# Altium project IFAT6.PrjPcb (part 1 of 3)
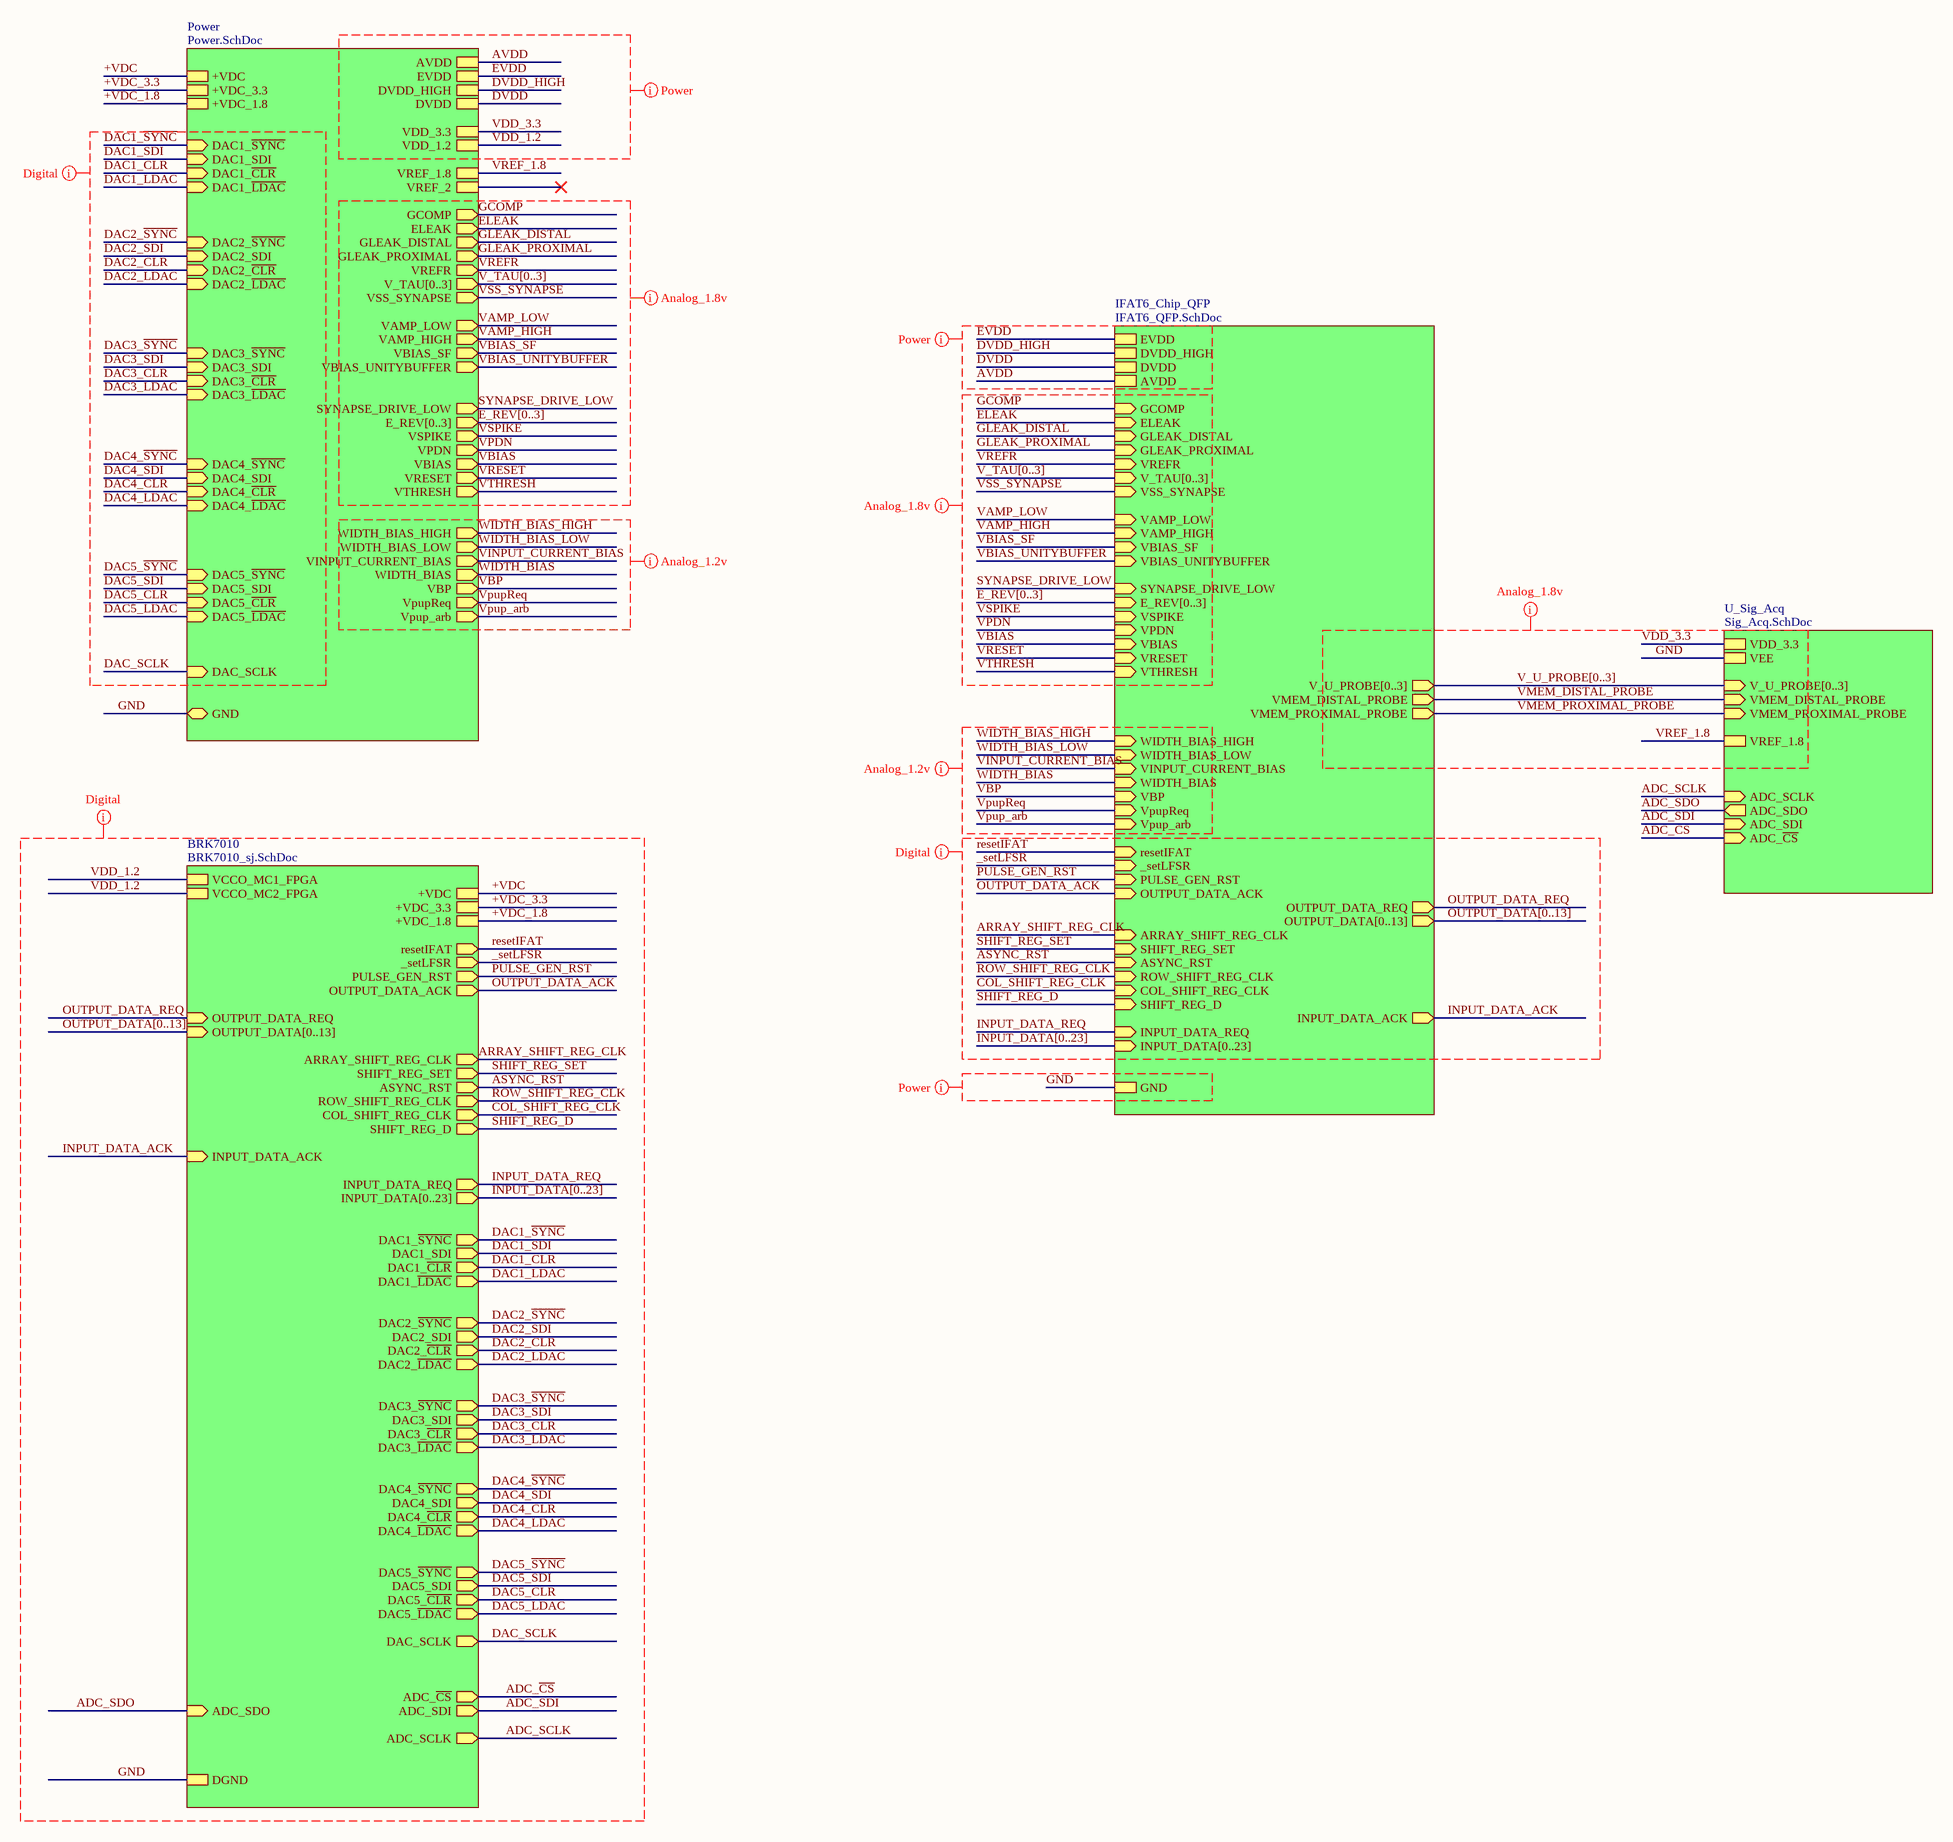
[diagram p0: IFAT6.SchDoc]
10 sheets, 589 parts. Net scope: strictly hierarchical (ports join the sheet entries above them; power ports are local).
Board file: IFAT6.PcbDoc
Sheets:
  IFAT6.SchDoc
    IFAT6_Chip_QFP = IFAT6_QFP.SchDoc
      C_EVDD = Capx3_small_bypass.SchDoc
      DVDD_HI = Capx3_small_bypass.SchDoc
      DVDD = Capx3_small_bypass.SchDoc
      VSS_SYN = Capx3_small_bypass.SchDoc
      VAMP_LOW = Capx3_small_bypass.SchDoc
      C_EVDD = Capx3_small_bypass.SchDoc
      GCOMP = Capx3_small_bypass.SchDoc
      ELEAK = Capx3_small_bypass.SchDoc
      C_AVDD = Capx3_small_bypass.SchDoc
      GL_DIS = Capx3_small_bypass.SchDoc
      GL_PROX = Capx3_small_bypass.SchDoc
      V_TAU3 = Capx3_small_bypass.SchDoc
      V_TAU2 = Capx3_small_bypass.SchDoc
      C_AVDD1 = Capx3_small_bypass.SchDoc
      V_TAU0 = Capx3_small_bypass.SchDoc
      VREFR = Capx3_small_bypass.SchDoc
      V_TAU1 = Capx3_small_bypass.SchDoc
      VAMP_HIGH = Capx3_small_bypass.SchDoc
      VBIAS_BUFF = Capx3_small_bypass.SchDoc
      SYN_DR_LO = Capx3_small_bypass.SchDoc
      VBIAS_SF = Capx3_small_bypass.SchDoc
      E_REV0 = Capx3_small_bypass.SchDoc
      E_REV1 = Capx3_small_bypass.SchDoc
      E_REV2 = Capx3_small_bypass.SchDoc
      E_REV3 = Capx3_small_bypass.SchDoc
      VSPIKE = Capx3_small_bypass.SchDoc
      WBIAS = Capx3_small_bypass.SchDoc
      VPDN = Capx3_small_bypass.SchDoc
      VBIAS = Capx3_small_bypass.SchDoc
      VRESET = Capx3_small_bypass.SchDoc
      VTHRESH = Capx3_small_bypass.SchDoc
      VIN_IBIAS = Capx3_small_bypass.SchDoc
      WBIAS_HI = Capx3_small_bypass.SchDoc
      WBIAS_LO = Capx3_small_bypass.SchDoc
      VBP = Capx3_small_bypass.SchDoc
      VpupReq = Capx3_small_bypass.SchDoc
      VpupArb = Capx3_small_bypass.SchDoc
    Power = Power.SchDoc
      LDO_All = LDO_All.SchDoc
        AVDD = LDO_Pos.SchDoc
          U_Capx4 = Capx4.SchDoc
        DVDD_HIGH = LDO_Pos.SchDoc
          U_Capx4 = Capx4.SchDoc
        EVDD = LDO_Pos.SchDoc
          U_Capx4 = Capx4.SchDoc
        DVDD = LDO_Pos.SchDoc
          U_Capx4 = Capx4.SchDoc
        VDD_3.3 = LDO_Pos.SchDoc
          U_Capx4 = Capx4.SchDoc
        VREF_2v = LDO_Pos.SchDoc
          U_Capx4 = Capx4.SchDoc
        VREF_1.8 = LDO_Pos.SchDoc
          U_Capx4 = Capx4.SchDoc
        VDD_1.2 = LDO_Pos.SchDoc
          U_Capx4 = Capx4.SchDoc
      DAC = DAC.SchDoc
        VREF_1.8_DAC = Capx4.SchDoc
        AVDD_DAC = Capx4.SchDoc
        EVDD_DAC = Capx4.SchDoc
        DVDD_DAC = Capx4.SchDoc
        DVDD_HI_DAC = Capx4.SchDoc
        VREF_2_DAC = Capx4.SchDoc
        VREF_DAC1 = Capx4.SchDoc
        VDC_DAC1 = Capx4.SchDoc
        VREF_DAC2 = Capx4.SchDoc
        VDC_DAC2 = Capx4.SchDoc
        VREF_DAC3 = Capx4.SchDoc
        VDC_DAC3 = Capx4.SchDoc
        VREF_DAC4 = Capx4.SchDoc
        VDC_DAC4 = Capx4.SchDoc
        VREF_DAC5 = Capx4.SchDoc
        VDC_DAC5 = Capx4.SchDoc
        VTAU1_DAC = Capx4.SchDoc
        GCOMP_DAC = Capx4.SchDoc
        EL_DAC = Capx4.SchDoc
        GLDIST_DAC = Capx4.SchDoc
        VTAU0_DAC = Capx4.SchDoc
        VTAU2_DAC = Capx4.SchDoc
        GLPROX_DAC = Capx4.SchDoc
        VTAU3_DAC = Capx4.SchDoc
        VB_BUFF_DAC = Capx4.SchDoc
        VREFR_DAC = Capx4.SchDoc
        VSS_SYN_DAC = Capx4.SchDoc
        VAMP_LOW_DAC = Capx4.SchDoc
        VBIAS_SF_DAC = Capx4.SchDoc
        SYN_DRLO_DAC = Capx4.SchDoc
        VAMP_HI_DAC = Capx4.SchDoc
        VSPIKE_DAC = Capx4.SchDoc
        VPDN_DAC = Capx4.SchDoc
        V_EREV0_DAC = Capx4.SchDoc
        V_EREV1_DAC = Capx4.SchDoc
        V_EREV2_DAC = Capx4.SchDoc
        V_EREV3_DAC = Capx4.SchDoc
        VBIAS_DAC = Capx4.SchDoc
        VRESET_DAC = Capx4.SchDoc
        VTHRESH_DAC = Capx4.SchDoc
        VBP_DAC = Capx4.SchDoc
        WBIAS_HI_DAC = Capx4.SchDoc
        WBIAS_LO_DAC = Capx4.SchDoc
        IN_IBIAS_DAC = Capx4.SchDoc
        WBIAS_DAC = Capx4.SchDoc
        VpupReq_DAC = Capx4.SchDoc
        Vpup_arb_DAC = Capx4.SchDoc
        VDD_1.2_DAC = Capx4.SchDoc
    U_Sig_Acq = Sig_Acq.SchDoc
      C_+VDC3 = Capx3_small_bypass.SchDoc
      C_+VDC2 = Capx3_small_bypass.SchDoc
      C_+VDC1 = Capx3_small_bypass.SchDoc
      DVDD_ADC = Capx4.SchDoc
      REF_ADC = Capx4.SchDoc
      AVDD_ADC = Capx4.SchDoc
    BRK7010 = BRK7010_sj.SchDoc
      +VDC_FPGA1 = Capx4.SchDoc
      C_VCCO2_FPGA = Capx3_small_bypass.SchDoc
      +VDC_FPGA2 = Capx4.SchDoc
      +VDC_FPGA3 = Capx4.SchDoc
      +VDC_FPGA5 = Capx3_small_bypass.SchDoc
      +VDC_FPGA6 = Capx3_small_bypass.SchDoc
      +VDC_FPGA4 = Capx4.SchDoc
      +VDC_FPGA7 = Capx3_small_bypass.SchDoc
      C_VCCO1_FPGA = Capx3_small_bypass.SchDoc

## Sheet IFAT6.SchDoc: IFAT6 PCB
size C; Revision: 1.0

### Sub-sheets
BRK7010 = BRK7010_sj.SchDoc: VCCO_MC2_FPGA, DGND, +VDC, +VDC_3.3, INPUT_DATA[0..23] (out), OUTPUT_DATA[0..13] (in), resetIFAT (out), _setLFSR (out), PULSE_GEN_RST (out), OUTPUT_DATA_ACK (out), OUTPUT_DATA_REQ (in), ARRAY_SHIFT_REG_CLK (out), SHIFT_REG_SET (out), ASYNC_RST (out), ROW_SHIFT_REG_CLK (out), COL_SHIFT_REG_CLK (out), SHIFT_REG_D (out), INPUT_DATA_ACK (in), INPUT_DATA_REQ (out), +VDC_1.8, DAC1_~{SYNC} (out), DAC1_SDI (out), DAC1_~{CLR} (out), DAC1_~{LDAC} (out), DAC2_~{SYNC} (out), DAC2_SDI (out), DAC2_~{CLR} (out), DAC2_~{LDAC} (out), DAC3_~{SYNC} (out), DAC3_SDI (out), DAC3_~{CLR} (out), DAC3_~{LDAC} (out), DAC4_~{CLR} (out), DAC4_~{LDAC} (out), DAC4_~{SYNC} (out), DAC4_SDI (out), DAC_SCLK (out), DAC5_~{LDAC} (out), DAC5_SDI (out), DAC5_~{CLR} (out), DAC5_~{SYNC} (out), ADC_SCLK (out), ADC_SDI (out), ADC_SDO (in), ADC_~{CS} (out), VCCO_MC1_FPGA
IFAT6_Chip_QFP = IFAT6_QFP.SchDoc: GCOMP (in), GLEAK_PROXIMAL (in), PULSE_GEN_RST (in), GND, SHIFT_REG_SET (in), INPUT_DATA[0..23] (in), EVDD, E_REV[0..3] (in), VBIAS (in), ELEAK (in), VMEM_DISTAL_PROBE (out), VSPIKE (in), SYNAPSE_DRIVE_LOW (in), VTHRESH (in), _setLFSR (in), COL_SHIFT_REG_CLK (in), WIDTH_BIAS_HIGH (in), VAMP_LOW (in), V_TAU[0..3] (in), ROW_SHIFT_REG_CLK (in), VPDN (in), VREFR (in), AVDD, ARRAY_SHIFT_REG_CLK (in), OUTPUT_DATA_ACK (in), VRESET (in), WIDTH_BIAS_LOW (in), VAMP_HIGH (in), OUTPUT_DATA_REQ (out), V_U_PROBE[0..3] (out), ASYNC_RST (in), OUTPUT_DATA[0..13] (out), SHIFT_REG_D (in), DVDD_HIGH, VBIAS_UNITYBUFFER (in), INPUT_DATA_REQ (in), VBIAS_SF (in), INPUT_DATA_ACK (out), VMEM_PROXIMAL_PROBE (out), GLEAK_DISTAL (in), VSS_SYNAPSE (in), VBP (in), Vpup_arb (in), DVDD, WIDTH_BIAS (in), VpupReq (in), VINPUT_CURRENT_BIAS (in), resetIFAT (in)
Power = Power.SchDoc: DVDD_HIGH, +VDC, AVDD, EVDD, DAC1_~{SYNC} (in), DAC1_SDI (in), DAC1_~{CLR} (in), DAC1_~{LDAC} (in), DAC2_~{SYNC} (in), DAC2_SDI (in), DAC2_~{CLR} (in), DAC2_~{LDAC} (in), +VDC_3.3, +VDC_1.8, GND (bidir), DAC3_~{SYNC} (in), DAC3_SDI (in), DAC3_~{CLR} (in), DAC3_~{LDAC} (in), DAC4_~{CLR} (in), DAC4_~{LDAC} (in), DAC4_~{SYNC} (in), DAC4_SDI (in), DVDD, VDD_3.3, GCOMP (out), ELEAK (out), GLEAK_DISTAL (out), GLEAK_PROXIMAL (out), VREFR (out), V_TAU[0..3] (out), VSS_SYNAPSE (out), VAMP_LOW (out), VAMP_HIGH (out), VBIAS_SF (out), VBIAS_UNITYBUFFER (out), SYNAPSE_DRIVE_LOW (out), E_REV[0..3] (out), VSPIKE (out), VPDN (out), VBIAS (out), VRESET (out), VTHRESH (out), WIDTH_BIAS_HIGH (out), WIDTH_BIAS_LOW (out), VINPUT_CURRENT_BIAS (out), WIDTH_BIAS (out), VBP (out), VpupReq (out), Vpup_arb (out), DAC_SCLK (in), VREF_1.8, VREF_2, DAC5_~{LDAC} (in), DAC5_SDI (in), DAC5_~{CLR} (in), DAC5_~{SYNC} (in), VDD_1.2
U_Sig_Acq = Sig_Acq.SchDoc: VDD_3.3, VEE, VMEM_DISTAL_PROBE (in), VMEM_PROXIMAL_PROBE (in), V_U_PROBE[0..3] (in), ADC_SCLK (in), ADC_SDI (in), ADC_SDO (out), ADC_~{CS} (in), VREF_1.8

### Nets
+VDC: sheet Power/+VDC, sheet BRK7010/+VDC
+VDC_1.8: sheet Power/+VDC_1.8, sheet BRK7010/+VDC_1.8
+VDC_3.3: sheet Power/+VDC_3.3, sheet BRK7010/+VDC_3.3
GND: sheet IFAT6_Chip_QFP/GND, sheet Power/GND, sheet U_Sig_Acq/VEE, sheet BRK7010/DGND  [project net DGND]
VDD_1.2: sheet Power/VDD_1.2, sheet BRK7010/VCCO_MC2_FPGA, sheet BRK7010/VCCO_MC1_FPGA  [project net VCCO_MC1]
_setLFSR: sheet IFAT6_Chip_QFP/_setLFSR, sheet BRK7010/_setLFSR
ADC_~{CS}: sheet U_Sig_Acq/ADC_~{CS}, sheet BRK7010/ADC_~{CS}
ADC_SCLK: sheet U_Sig_Acq/ADC_SCLK, sheet BRK7010/ADC_SCLK
ADC_SDI: sheet U_Sig_Acq/ADC_SDI, sheet BRK7010/ADC_SDI
ADC_SDO: sheet U_Sig_Acq/ADC_SDO, sheet BRK7010/ADC_SDO
ARRAY_SHIFT_REG_CLK: sheet IFAT6_Chip_QFP/ARRAY_SHIFT_REG_CLK, sheet BRK7010/ARRAY_SHIFT_REG_CLK
ASYNC_RST: sheet IFAT6_Chip_QFP/ASYNC_RST, sheet BRK7010/ASYNC_RST
AVDD: sheet IFAT6_Chip_QFP/AVDD, sheet Power/AVDD
COL_SHIFT_REG_CLK: sheet IFAT6_Chip_QFP/COL_SHIFT_REG_CLK, sheet BRK7010/COL_SHIFT_REG_CLK
DAC1_~{CLR}: sheet Power/DAC1_~{CLR}, sheet BRK7010/DAC1_~{CLR}
DAC1_~{LDAC}: sheet Power/DAC1_~{LDAC}, sheet BRK7010/DAC1_~{LDAC}
DAC1_~{SYNC}: sheet Power/DAC1_~{SYNC}, sheet BRK7010/DAC1_~{SYNC}
DAC1_SDI: sheet Power/DAC1_SDI, sheet BRK7010/DAC1_SDI
DAC2_~{CLR}: sheet Power/DAC2_~{CLR}, sheet BRK7010/DAC2_~{CLR}
DAC2_~{LDAC}: sheet Power/DAC2_~{LDAC}, sheet BRK7010/DAC2_~{LDAC}
DAC2_~{SYNC}: sheet Power/DAC2_~{SYNC}, sheet BRK7010/DAC2_~{SYNC}
DAC2_SDI: sheet Power/DAC2_SDI, sheet BRK7010/DAC2_SDI
DAC3_~{CLR}: sheet Power/DAC3_~{CLR}, sheet BRK7010/DAC3_~{CLR}
DAC3_~{LDAC}: sheet Power/DAC3_~{LDAC}, sheet BRK7010/DAC3_~{LDAC}
DAC3_~{SYNC}: sheet Power/DAC3_~{SYNC}, sheet BRK7010/DAC3_~{SYNC}
DAC3_SDI: sheet Power/DAC3_SDI, sheet BRK7010/DAC3_SDI
DAC4_~{CLR}: sheet Power/DAC4_~{CLR}, sheet BRK7010/DAC4_~{CLR}
DAC4_~{LDAC}: sheet Power/DAC4_~{LDAC}, sheet BRK7010/DAC4_~{LDAC}
DAC4_~{SYNC}: sheet Power/DAC4_~{SYNC}, sheet BRK7010/DAC4_~{SYNC}
DAC4_SDI: sheet Power/DAC4_SDI, sheet BRK7010/DAC4_SDI
DAC5_~{CLR}: sheet Power/DAC5_~{CLR}, sheet BRK7010/DAC5_~{CLR}
DAC5_~{LDAC}: sheet Power/DAC5_~{LDAC}, sheet BRK7010/DAC5_~{LDAC}
DAC5_~{SYNC}: sheet Power/DAC5_~{SYNC}, sheet BRK7010/DAC5_~{SYNC}
DAC5_SDI: sheet Power/DAC5_SDI, sheet BRK7010/DAC5_SDI
DAC_SCLK: sheet Power/DAC_SCLK, sheet BRK7010/DAC_SCLK
DVDD: sheet IFAT6_Chip_QFP/DVDD, sheet Power/DVDD
DVDD_HIGH: sheet IFAT6_Chip_QFP/DVDD_HIGH, sheet Power/DVDD_HIGH
ELEAK: sheet IFAT6_Chip_QFP/ELEAK, sheet Power/ELEAK
EVDD: sheet IFAT6_Chip_QFP/EVDD, sheet Power/EVDD
GCOMP: sheet IFAT6_Chip_QFP/GCOMP, sheet Power/GCOMP
GLEAK_DISTAL: sheet IFAT6_Chip_QFP/GLEAK_DISTAL, sheet Power/GLEAK_DISTAL
GLEAK_PROXIMAL: sheet IFAT6_Chip_QFP/GLEAK_PROXIMAL, sheet Power/GLEAK_PROXIMAL
INPUT_DATA_ACK: sheet IFAT6_Chip_QFP/INPUT_DATA_ACK, sheet BRK7010/INPUT_DATA_ACK
INPUT_DATA_REQ: sheet IFAT6_Chip_QFP/INPUT_DATA_REQ, sheet BRK7010/INPUT_DATA_REQ
OUTPUT_DATA_ACK: sheet IFAT6_Chip_QFP/OUTPUT_DATA_ACK, sheet BRK7010/OUTPUT_DATA_ACK  [project net MC2_48]
OUTPUT_DATA_REQ: sheet IFAT6_Chip_QFP/OUTPUT_DATA_REQ, sheet BRK7010/OUTPUT_DATA_REQ  [project net MC2_50]
PULSE_GEN_RST: sheet IFAT6_Chip_QFP/PULSE_GEN_RST, sheet BRK7010/PULSE_GEN_RST  [project net MC2_46]
resetIFAT: sheet IFAT6_Chip_QFP/resetIFAT, sheet BRK7010/resetIFAT  [project net MC2_42]
ROW_SHIFT_REG_CLK: sheet IFAT6_Chip_QFP/ROW_SHIFT_REG_CLK, sheet BRK7010/ROW_SHIFT_REG_CLK  [project net MC1_52]
SHIFT_REG_D: sheet IFAT6_Chip_QFP/SHIFT_REG_D, sheet BRK7010/SHIFT_REG_D  [project net MC1_58]
SHIFT_REG_SET: sheet IFAT6_Chip_QFP/SHIFT_REG_SET, sheet BRK7010/SHIFT_REG_SET  [project net MC2_18]
SYNAPSE_DRIVE_LOW: sheet IFAT6_Chip_QFP/SYNAPSE_DRIVE_LOW, sheet Power/SYNAPSE_DRIVE_LOW
VAMP_HIGH: sheet IFAT6_Chip_QFP/VAMP_HIGH, sheet Power/VAMP_HIGH
VAMP_LOW: sheet IFAT6_Chip_QFP/VAMP_LOW, sheet Power/VAMP_LOW
VBIAS: sheet IFAT6_Chip_QFP/VBIAS, sheet Power/VBIAS
VBIAS_SF: sheet IFAT6_Chip_QFP/VBIAS_SF, sheet Power/VBIAS_SF
VBIAS_UNITYBUFFER: sheet IFAT6_Chip_QFP/VBIAS_UNITYBUFFER, sheet Power/VBIAS_UNITYBUFFER
VBP: sheet IFAT6_Chip_QFP/VBP, sheet Power/VBP
VDD_3.3: sheet Power/VDD_3.3, sheet U_Sig_Acq/VDD_3.3  [project net VDD3.3]
VINPUT_CURRENT_BIAS: sheet IFAT6_Chip_QFP/VINPUT_CURRENT_BIAS, sheet Power/VINPUT_CURRENT_BIAS
VMEM_DISTAL_PROBE: sheet IFAT6_Chip_QFP/VMEM_DISTAL_PROBE, sheet U_Sig_Acq/VMEM_DISTAL_PROBE
VMEM_PROXIMAL_PROBE: sheet IFAT6_Chip_QFP/VMEM_PROXIMAL_PROBE, sheet U_Sig_Acq/VMEM_PROXIMAL_PROBE
VPDN: sheet IFAT6_Chip_QFP/VPDN, sheet Power/VPDN
Vpup_arb: sheet IFAT6_Chip_QFP/Vpup_arb, sheet Power/Vpup_arb
VpupReq: sheet IFAT6_Chip_QFP/VpupReq, sheet Power/VpupReq
VREF_1.8: sheet Power/VREF_1.8, sheet U_Sig_Acq/VREF_1.8  [project net DAC_VREF_1.8]
VREFR: sheet IFAT6_Chip_QFP/VREFR, sheet Power/VREFR
VRESET: sheet IFAT6_Chip_QFP/VRESET, sheet Power/VRESET
VSPIKE: sheet IFAT6_Chip_QFP/VSPIKE, sheet Power/VSPIKE
VSS_SYNAPSE: sheet IFAT6_Chip_QFP/VSS_SYNAPSE, sheet Power/VSS_SYNAPSE
VTHRESH: sheet IFAT6_Chip_QFP/VTHRESH, sheet Power/VTHRESH
WIDTH_BIAS: sheet IFAT6_Chip_QFP/WIDTH_BIAS, sheet Power/WIDTH_BIAS
WIDTH_BIAS_HIGH: sheet IFAT6_Chip_QFP/WIDTH_BIAS_HIGH, sheet Power/WIDTH_BIAS_HIGH
WIDTH_BIAS_LOW: sheet IFAT6_Chip_QFP/WIDTH_BIAS_LOW, sheet Power/WIDTH_BIAS_LOW

### Buses and harness runs
bus E_REV[0..3] = sheet IFAT6_Chip_QFP/E_REV[0..3]
bus E_REV[0..3] = sheet Power/E_REV[0..3]
bus INPUT_DATA[0..23] = sheet BRK7010/INPUT_DATA[0..23]
bus INPUT_DATA[0..23] = sheet IFAT6_Chip_QFP/INPUT_DATA[0..23]
bus OUTPUT_DATA[0..13] = sheet BRK7010/OUTPUT_DATA[0..13]
bus OUTPUT_DATA[0..13] = sheet IFAT6_Chip_QFP/OUTPUT_DATA[0..13]
bus V_TAU[0..3] = sheet IFAT6_Chip_QFP/V_TAU[0..3]
bus V_TAU[0..3] = sheet Power/V_TAU[0..3]
bus V_U_PROBE[0..3] = sheet IFAT6_Chip_QFP/V_U_PROBE[0..3] = sheet U_Sig_Acq/V_U_PROBE[0..3]

### Layout directives
mark named Analog_1.8v: E_REV[0..3], ELEAK, GCOMP, GLEAK_DISTAL, GLEAK_PROXIMAL, GND, SYNAPSE_DRIVE_LOW, V_TAU[0..3], V_U_PROBE[0..3], VAMP_HIGH, VAMP_LOW, VBIAS, VBIAS_SF, VBIAS_UNITYBUFFER, VDD_3.3, VMEM_DISTAL_PROBE, VMEM_PROXIMAL_PROBE, VPDN, VREF_1.8, VREFR, VRESET, VSPIKE, VSS_SYNAPSE, VTHRESH
mark named Digital: +VDC, +VDC_1.8, +VDC_3.3, _setLFSR, ADC_SCLK, ADC_SDI, ADC_SDO, ADC_~{CS}, ARRAY_SHIFT_REG_CLK, ASYNC_RST, COL_SHIFT_REG_CLK, DAC1_SDI, DAC1_~{CLR}, DAC1_~{LDAC}, DAC1_~{SYNC}, DAC2_SDI, DAC2_~{CLR}, DAC2_~{LDAC}, DAC2_~{SYNC}, DAC3_SDI, DAC3_~{CLR}, DAC3_~{LDAC}, DAC3_~{SYNC}, DAC4_SDI, DAC4_~{CLR}, DAC4_~{LDAC}, DAC4_~{SYNC}, DAC5_SDI, DAC5_~{CLR}, DAC5_~{LDAC}, DAC5_~{SYNC}, DAC_SCLK, GND, INPUT_DATA[0..23], INPUT_DATA_ACK, INPUT_DATA_REQ, OUTPUT_DATA[0..13], OUTPUT_DATA_ACK, OUTPUT_DATA_REQ, PULSE_GEN_RST, resetIFAT, ROW_SHIFT_REG_CLK, SHIFT_REG_D, SHIFT_REG_SET, VDD_1.2
mark named Power: AVDD, DVDD, DVDD_HIGH, EVDD, GND, VDD_1.2, VDD_3.3
mark named Analog_1.2v: VBP, VINPUT_CURRENT_BIAS, Vpup_arb, VpupReq, WIDTH_BIAS, WIDTH_BIAS_HIGH, WIDTH_BIAS_LOW

## Sheet IFAT6_QFP.SchDoc
size 457 x 254 mm
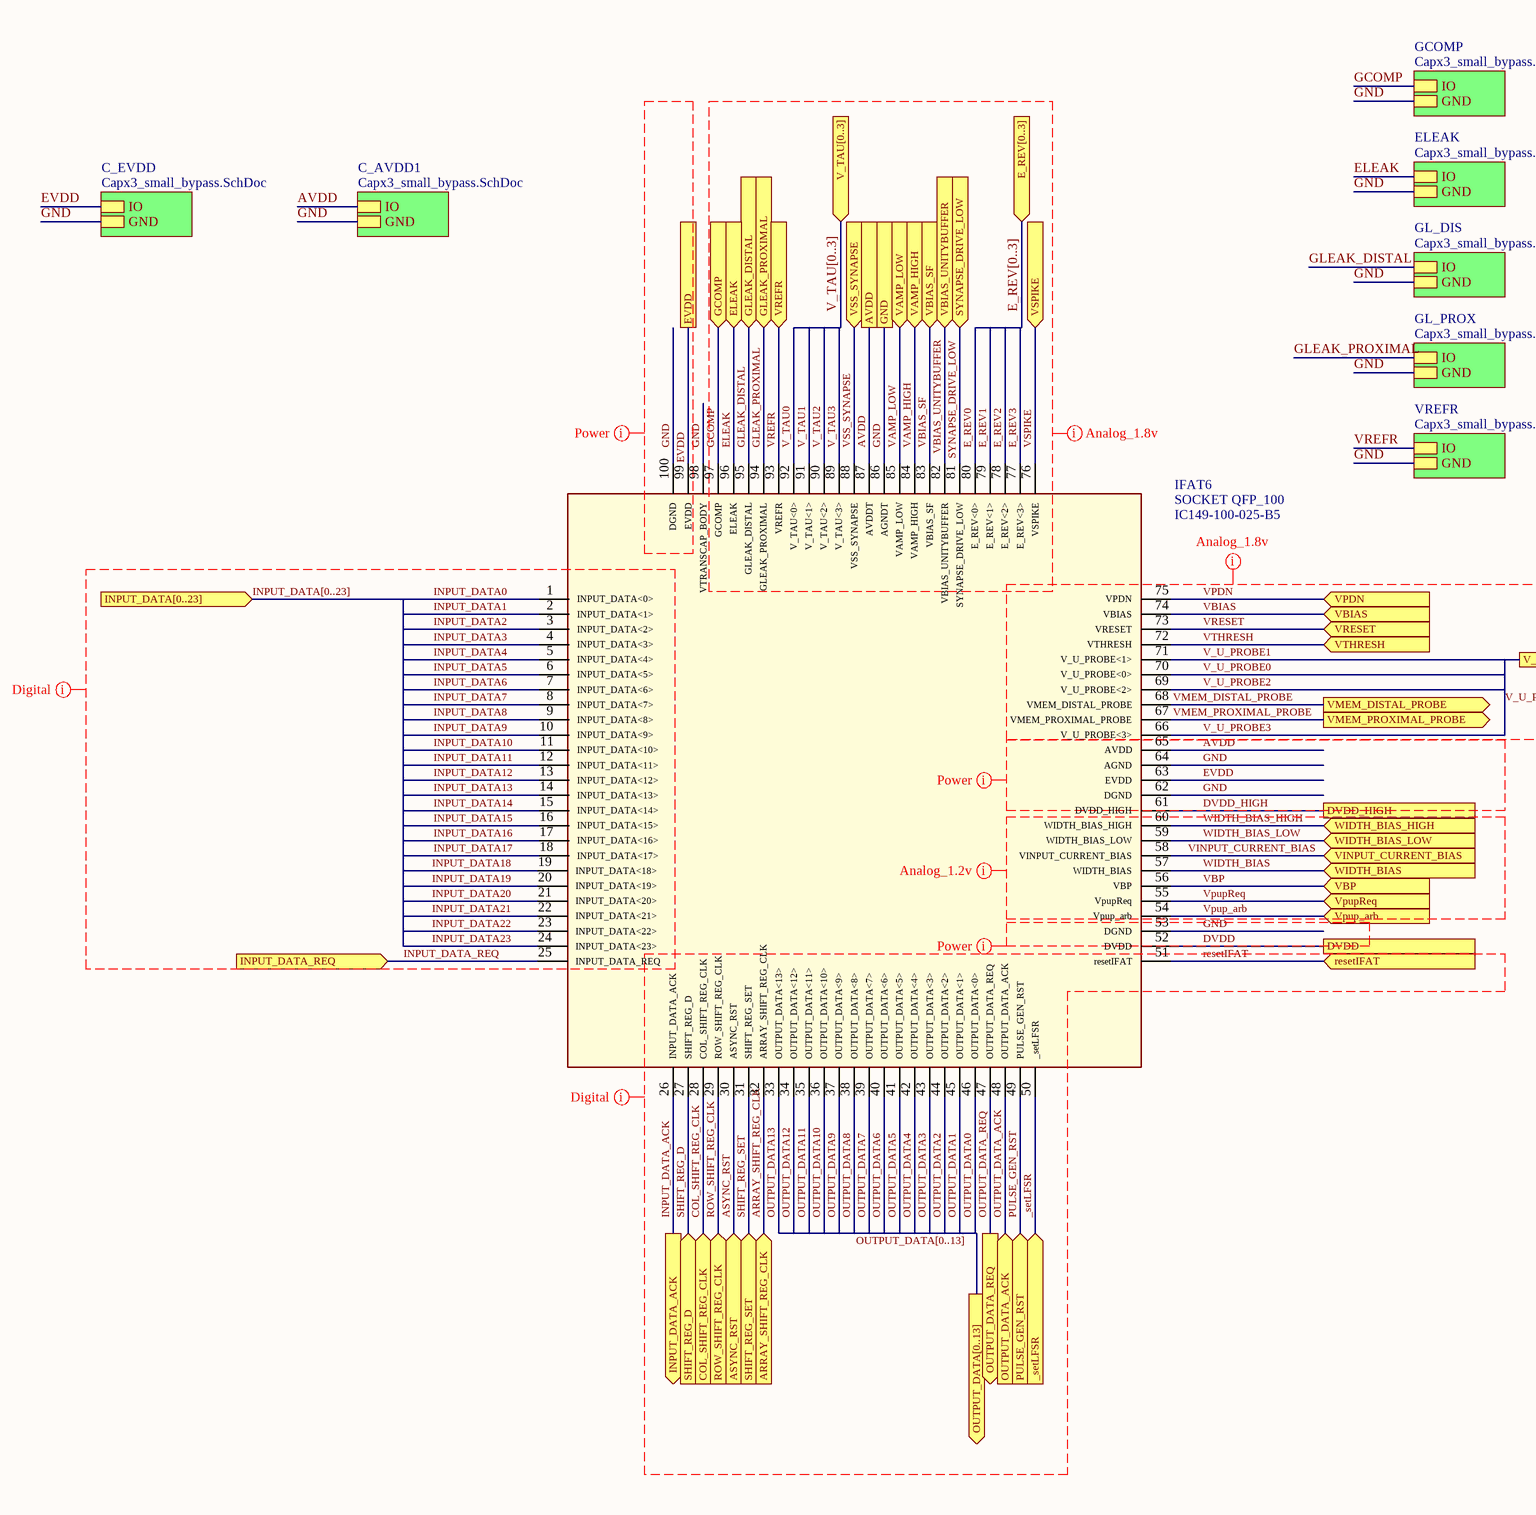
[diagram p1: IFAT6_QFP.SchDoc, left]
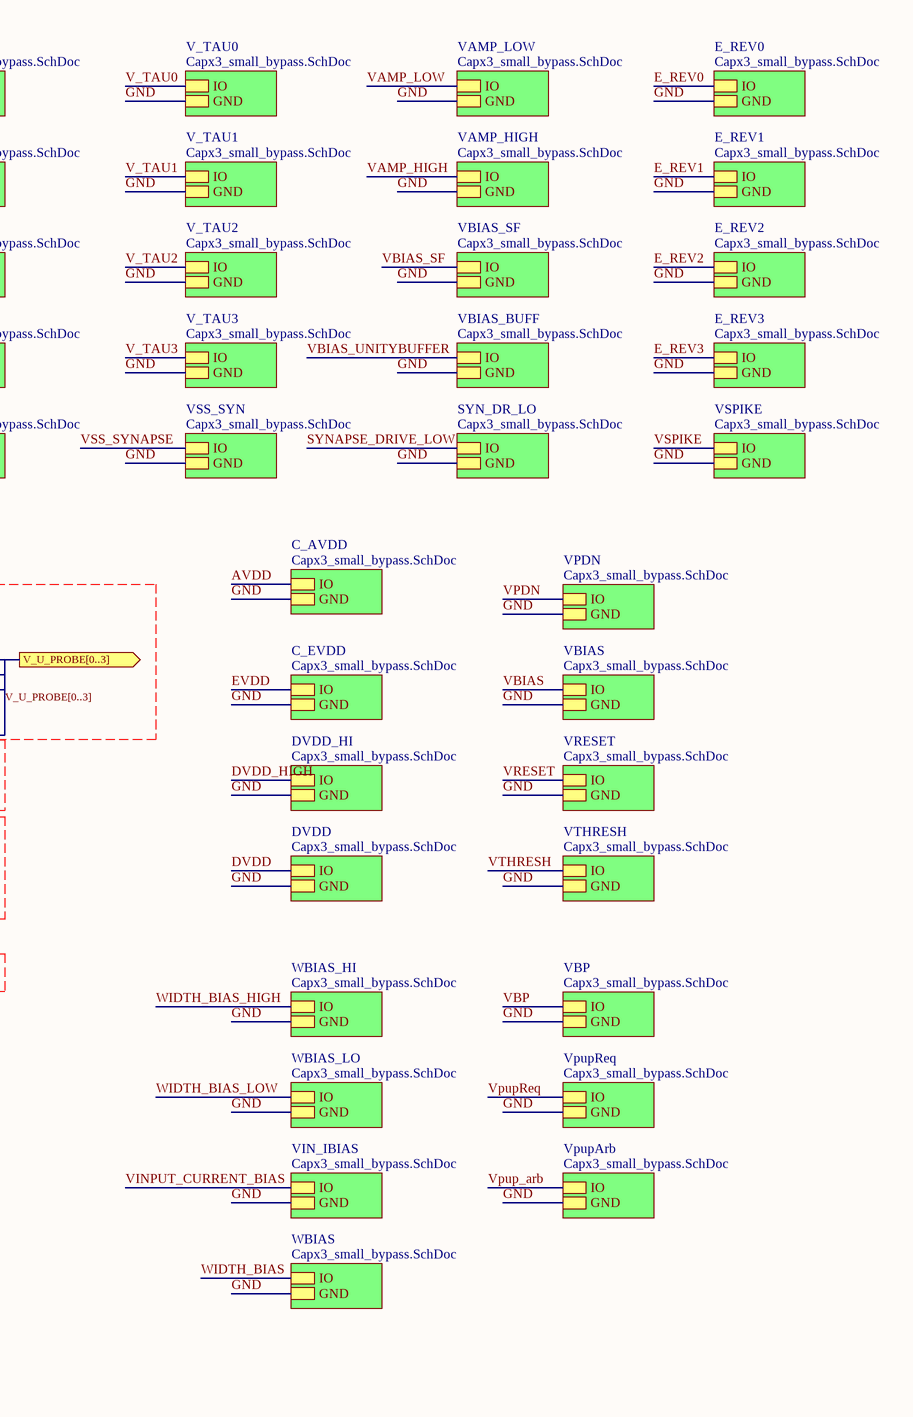
[diagram p2: IFAT6_QFP.SchDoc, right]

### Parts
IFAT6  SOCKET QFP_100  Manufacturer_Part_Number: IC149-100-025-B5  [YAMAICHI_IC149-100-025-B5]

### Sub-sheets
C_AVDD = Capx3_small_bypass.SchDoc: IO, GND
C_AVDD1 = Capx3_small_bypass.SchDoc: IO, GND
C_EVDD = Capx3_small_bypass.SchDoc: IO, GND
C_EVDD = Capx3_small_bypass.SchDoc: IO, GND
DVDD = Capx3_small_bypass.SchDoc: IO, GND
DVDD_HI = Capx3_small_bypass.SchDoc: IO, GND
E_REV0 = Capx3_small_bypass.SchDoc: IO, GND
E_REV1 = Capx3_small_bypass.SchDoc: IO, GND
E_REV2 = Capx3_small_bypass.SchDoc: IO, GND
E_REV3 = Capx3_small_bypass.SchDoc: IO, GND
ELEAK = Capx3_small_bypass.SchDoc: IO, GND
GCOMP = Capx3_small_bypass.SchDoc: IO, GND
GL_DIS = Capx3_small_bypass.SchDoc: IO, GND
GL_PROX = Capx3_small_bypass.SchDoc: IO, GND
SYN_DR_LO = Capx3_small_bypass.SchDoc: IO, GND
V_TAU0 = Capx3_small_bypass.SchDoc: IO, GND
V_TAU1 = Capx3_small_bypass.SchDoc: IO, GND
V_TAU2 = Capx3_small_bypass.SchDoc: IO, GND
V_TAU3 = Capx3_small_bypass.SchDoc: IO, GND
VAMP_HIGH = Capx3_small_bypass.SchDoc: IO, GND
VAMP_LOW = Capx3_small_bypass.SchDoc: IO, GND
VBIAS = Capx3_small_bypass.SchDoc: IO, GND
VBIAS_BUFF = Capx3_small_bypass.SchDoc: IO, GND
VBIAS_SF = Capx3_small_bypass.SchDoc: IO, GND
VBP = Capx3_small_bypass.SchDoc: IO, GND
VIN_IBIAS = Capx3_small_bypass.SchDoc: IO, GND
VPDN = Capx3_small_bypass.SchDoc: IO, GND
VpupArb = Capx3_small_bypass.SchDoc: IO, GND
VpupReq = Capx3_small_bypass.SchDoc: IO, GND
VREFR = Capx3_small_bypass.SchDoc: IO, GND
VRESET = Capx3_small_bypass.SchDoc: IO, GND
VSPIKE = Capx3_small_bypass.SchDoc: IO, GND
VSS_SYN = Capx3_small_bypass.SchDoc: IO, GND
VTHRESH = Capx3_small_bypass.SchDoc: IO, GND
WBIAS = Capx3_small_bypass.SchDoc: IO, GND
WBIAS_HI = Capx3_small_bypass.SchDoc: IO, GND
WBIAS_LO = Capx3_small_bypass.SchDoc: IO, GND

### Ports
_setLFSR (in), ARRAY_SHIFT_REG_CLK (in), ASYNC_RST (in), AVDD, COL_SHIFT_REG_CLK (in), DVDD, DVDD_HIGH, E_REV[0..3] (in), ELEAK (in), EVDD, GCOMP (in), GLEAK_DISTAL (in), GLEAK_PROXIMAL (in), GND, INPUT_DATA[0..23] (in), INPUT_DATA_ACK (out), INPUT_DATA_REQ (in), OUTPUT_DATA[0..13] (out), OUTPUT_DATA_ACK (in), OUTPUT_DATA_REQ (out), PULSE_GEN_RST (in), resetIFAT (in), ROW_SHIFT_REG_CLK (in), SHIFT_REG_D (in), SHIFT_REG_SET (in), SYNAPSE_DRIVE_LOW (in), V_TAU[0..3] (in), V_U_PROBE[0..3] (out), VAMP_HIGH (in), VAMP_LOW (in), VBIAS (in), VBIAS_SF (in), VBIAS_UNITYBUFFER (in), VBP (in), VINPUT_CURRENT_BIAS (in), VMEM_DISTAL_PROBE (out), VMEM_PROXIMAL_PROBE (out), VPDN (in), Vpup_arb (in), VpupReq (in), VREFR (in), VRESET (in), VSPIKE (in), VSS_SYNAPSE (in), VTHRESH (in), WIDTH_BIAS (in), WIDTH_BIAS_HIGH (in), WIDTH_BIAS_LOW (in)

### Nets
GND: IFAT6.53(DGND) IFAT6.62(DGND) IFAT6.64(AGND) IFAT6.86(AGNDT) IFAT6.98(VTRANSCAP_BODY) IFAT6.100(DGND) ; port GND, sheet C_EVDD/GND, sheet DVDD_HI/GND, sheet DVDD/GND, sheet VSS_SYN/GND, sheet VAMP_LOW/GND, sheet C_EVDD/GND, sheet GCOMP/GND, sheet ELEAK/GND, sheet C_AVDD/GND, sheet GL_DIS/GND, sheet GL_PROX/GND, sheet V_TAU3/GND, sheet V_TAU2/GND, sheet C_AVDD1/GND, sheet V_TAU0/GND, sheet VREFR/GND, sheet V_TAU1/GND, sheet VAMP_HIGH/GND, sheet VBIAS_BUFF/GND, sheet SYN_DR_LO/GND, sheet VBIAS_SF/GND, sheet E_REV0/GND, sheet E_REV1/GND, sheet E_REV2/GND, sheet E_REV3/GND, sheet VSPIKE/GND, sheet WBIAS/GND, sheet VPDN/GND, sheet VBIAS/GND, sheet VRESET/GND, sheet VTHRESH/GND, sheet VIN_IBIAS/GND, sheet WBIAS_HI/GND, sheet WBIAS_LO/GND, sheet VBP/GND, sheet VpupReq/GND, sheet VpupArb/GND  [project net DGND]
_setLFSR: IFAT6.50(_setLFSR) ; port _setLFSR
ARRAY_SHIFT_REG_CLK: IFAT6.32(ARRAY_SHIFT_REG_CLK) ; port ARRAY_SHIFT_REG_CLK
ASYNC_RST: IFAT6.30(ASYNC_RST) ; port ASYNC_RST
AVDD: IFAT6.65(AVDD) IFAT6.87(AVDDT) ; port AVDD, sheet C_AVDD/IO, sheet C_AVDD1/IO
COL_SHIFT_REG_CLK: IFAT6.28(COL_SHIFT_REG_CLK) ; port COL_SHIFT_REG_CLK
DVDD: IFAT6.52(DVDD) ; port DVDD, sheet DVDD/IO
DVDD_HIGH: IFAT6.61(DVDD_HIGH) ; port DVDD_HIGH, sheet DVDD_HI/IO
E_REV0: IFAT6.80(E_REV<0>) ; sheet E_REV0/IO
E_REV1: IFAT6.79(E_REV<1>) ; sheet E_REV1/IO
E_REV2: IFAT6.78(E_REV<2>) ; sheet E_REV2/IO
E_REV3: IFAT6.77(E_REV<3>) ; sheet E_REV3/IO
ELEAK: IFAT6.96(ELEAK) ; port ELEAK, sheet ELEAK/IO
EVDD: IFAT6.63(EVDD) IFAT6.99(EVDD) ; port EVDD, sheet C_EVDD/IO, sheet C_EVDD/IO
GCOMP: IFAT6.97(GCOMP) ; port GCOMP, sheet GCOMP/IO
GLEAK_DISTAL: IFAT6.95(GLEAK_DISTAL) ; port GLEAK_DISTAL, sheet GL_DIS/IO
GLEAK_PROXIMAL: IFAT6.94(GLEAK_PROXIMAL) ; port GLEAK_PROXIMAL, sheet GL_PROX/IO
INPUT_DATA0: IFAT6.1(INPUT_DATA<0>)
INPUT_DATA1: IFAT6.2(INPUT_DATA<1>)
INPUT_DATA2: IFAT6.3(INPUT_DATA<2>)
INPUT_DATA3: IFAT6.4(INPUT_DATA<3>)
INPUT_DATA4: IFAT6.5(INPUT_DATA<4>)
INPUT_DATA5: IFAT6.6(INPUT_DATA<5>)
INPUT_DATA6: IFAT6.7(INPUT_DATA<6>)
INPUT_DATA7: IFAT6.8(INPUT_DATA<7>)
INPUT_DATA8: IFAT6.9(INPUT_DATA<8>)
INPUT_DATA9: IFAT6.10(INPUT_DATA<9>)
INPUT_DATA10: IFAT6.11(INPUT_DATA<10>)
INPUT_DATA11: IFAT6.12(INPUT_DATA<11>)
INPUT_DATA12: IFAT6.13(INPUT_DATA<12>)
INPUT_DATA13: IFAT6.14(INPUT_DATA<13>)
INPUT_DATA14: IFAT6.15(INPUT_DATA<14>)
INPUT_DATA15: IFAT6.16(INPUT_DATA<15>)
INPUT_DATA16: IFAT6.17(INPUT_DATA<16>)
INPUT_DATA17: IFAT6.18(INPUT_DATA<17>)
INPUT_DATA18: IFAT6.19(INPUT_DATA<18>)
INPUT_DATA19: IFAT6.20(INPUT_DATA<19>)
INPUT_DATA20: IFAT6.21(INPUT_DATA<20>)
INPUT_DATA21: IFAT6.22(INPUT_DATA<21>)
INPUT_DATA22: IFAT6.23(INPUT_DATA<22>)
INPUT_DATA23: IFAT6.24(INPUT_DATA<23>)
INPUT_DATA_ACK: IFAT6.26(INPUT_DATA_ACK) ; port INPUT_DATA_ACK
INPUT_DATA_REQ: IFAT6.25(INPUT_DATA_REQ) ; port INPUT_DATA_REQ
OUTPUT_DATA0: IFAT6.46(OUTPUT_DATA<0>)  [project net MC2_52]
OUTPUT_DATA1: IFAT6.45(OUTPUT_DATA<1>)  [project net MC2_54]
OUTPUT_DATA2: IFAT6.44(OUTPUT_DATA<2>)  [project net MC2_58]
OUTPUT_DATA3: IFAT6.43(OUTPUT_DATA<3>)  [project net MC2_60]
OUTPUT_DATA4: IFAT6.42(OUTPUT_DATA<4>)  [project net MC2_62]
OUTPUT_DATA5: IFAT6.41(OUTPUT_DATA<5>)  [project net MC2_40]
OUTPUT_DATA6: IFAT6.40(OUTPUT_DATA<6>)  [project net MC2_38]
OUTPUT_DATA7: IFAT6.39(OUTPUT_DATA<7>)  [project net MC2_34]
OUTPUT_DATA8: IFAT6.38(OUTPUT_DATA<8>)  [project net MC2_32]
OUTPUT_DATA9: IFAT6.37(OUTPUT_DATA<9>)  [project net MC2_30]
OUTPUT_DATA10: IFAT6.36(OUTPUT_DATA<10>)  [project net MC2_28]
OUTPUT_DATA11: IFAT6.35(OUTPUT_DATA<11>)  [project net MC2_26]
OUTPUT_DATA12: IFAT6.34(OUTPUT_DATA<12>)  [project net MC2_24]
OUTPUT_DATA13: IFAT6.33(OUTPUT_DATA<13>)  [project net MC2_22]
OUTPUT_DATA_ACK: IFAT6.48(OUTPUT_DATA_ACK) ; port OUTPUT_DATA_ACK  [project net MC2_48]
OUTPUT_DATA_REQ: IFAT6.47(OUTPUT_DATA_REQ) ; port OUTPUT_DATA_REQ  [project net MC2_50]
PULSE_GEN_RST: IFAT6.49(PULSE_GEN_RST) ; port PULSE_GEN_RST  [project net MC2_46]
resetIFAT: IFAT6.51(resetIFAT) ; port resetIFAT  [project net MC2_42]
ROW_SHIFT_REG_CLK: IFAT6.29(ROW_SHIFT_REG_CLK) ; port ROW_SHIFT_REG_CLK  [project net MC1_52]
SHIFT_REG_D: IFAT6.27(SHIFT_REG_D) ; port SHIFT_REG_D  [project net MC1_58]
SHIFT_REG_SET: IFAT6.31(SHIFT_REG_SET) ; port SHIFT_REG_SET  [project net MC2_18]
SYNAPSE_DRIVE_LOW: IFAT6.81(SYNAPSE_DRIVE_LOW) ; port SYNAPSE_DRIVE_LOW, sheet SYN_DR_LO/IO
V_TAU0: IFAT6.92(V_TAU<0>) ; sheet V_TAU0/IO
V_TAU1: IFAT6.91(V_TAU<1>) ; sheet V_TAU1/IO
V_TAU2: IFAT6.90(V_TAU<2>) ; sheet V_TAU2/IO
V_TAU3: IFAT6.89(V_TAU<3>) ; sheet V_TAU3/IO
V_U_PROBE0: IFAT6.70(V_U_PROBE<0>)
V_U_PROBE1: IFAT6.71(V_U_PROBE<1>)
V_U_PROBE2: IFAT6.69(V_U_PROBE<2>)
V_U_PROBE3: IFAT6.66(V_U_PROBE<3>)
VAMP_HIGH: IFAT6.84(VAMP_HIGH) ; port VAMP_HIGH, sheet VAMP_HIGH/IO
VAMP_LOW: IFAT6.85(VAMP_LOW) ; port VAMP_LOW, sheet VAMP_LOW/IO
VBIAS: IFAT6.74(VBIAS) ; port VBIAS, sheet VBIAS/IO
VBIAS_SF: IFAT6.83(VBIAS_SF) ; port VBIAS_SF, sheet VBIAS_SF/IO
VBIAS_UNITYBUFFER: IFAT6.82(VBIAS_UNITYBUFFER) ; port VBIAS_UNITYBUFFER, sheet VBIAS_BUFF/IO
VBP: IFAT6.56(VBP) ; port VBP, sheet VBP/IO
VINPUT_CURRENT_BIAS: IFAT6.58(VINPUT_CURRENT_BIAS) ; port VINPUT_CURRENT_BIAS, sheet VIN_IBIAS/IO
VMEM_DISTAL_PROBE: IFAT6.68(VMEM_DISTAL_PROBE) ; port VMEM_DISTAL_PROBE
VMEM_PROXIMAL_PROBE: IFAT6.67(VMEM_PROXIMAL_PROBE) ; port VMEM_PROXIMAL_PROBE
VPDN: IFAT6.75(VPDN) ; port VPDN, sheet VPDN/IO
Vpup_arb: IFAT6.54(Vpup_arb) ; port Vpup_arb, sheet VpupArb/IO
VpupReq: IFAT6.55(VpupReq) ; port VpupReq, sheet VpupReq/IO
VREFR: IFAT6.93(VREFR) ; port VREFR, sheet VREFR/IO
VRESET: IFAT6.73(VRESET) ; port VRESET, sheet VRESET/IO
VSPIKE: IFAT6.76(VSPIKE) ; port VSPIKE, sheet VSPIKE/IO
VSS_SYNAPSE: IFAT6.88(VSS_SYNAPSE) ; port VSS_SYNAPSE, sheet VSS_SYN/IO
VTHRESH: IFAT6.72(VTHRESH) ; port VTHRESH, sheet VTHRESH/IO
WIDTH_BIAS: IFAT6.57(WIDTH_BIAS) ; port WIDTH_BIAS, sheet WBIAS/IO
WIDTH_BIAS_HIGH: IFAT6.60(WIDTH_BIAS_HIGH) ; port WIDTH_BIAS_HIGH, sheet WBIAS_HI/IO
WIDTH_BIAS_LOW: IFAT6.59(WIDTH_BIAS_LOW) ; port WIDTH_BIAS_LOW, sheet WBIAS_LO/IO

### Buses and harness runs
bus E_REV[0..3] = port E_REV[0..3]
bus INPUT_DATA[0..23] = port INPUT_DATA[0..23]
bus OUTPUT_DATA[0..13] = port OUTPUT_DATA[0..13]
bus V_TAU[0..3] = port V_TAU[0..3]
bus V_U_PROBE[0..3] = port V_U_PROBE[0..3]

### Layout directives
mark named Digital: _setLFSR, ARRAY_SHIFT_REG_CLK, ASYNC_RST, COL_SHIFT_REG_CLK, INPUT_DATA0, INPUT_DATA1, INPUT_DATA2, INPUT_DATA3, INPUT_DATA4, INPUT_DATA5, INPUT_DATA6, INPUT_DATA7, INPUT_DATA8, INPUT_DATA9, INPUT_DATA10, INPUT_DATA11, INPUT_DATA12, INPUT_DATA13, INPUT_DATA14, INPUT_DATA15, INPUT_DATA16, INPUT_DATA17, INPUT_DATA18, INPUT_DATA19, INPUT_DATA20, INPUT_DATA21, INPUT_DATA22, INPUT_DATA23, INPUT_DATA[0..23], INPUT_DATA_ACK, INPUT_DATA_REQ, OUTPUT_DATA0, OUTPUT_DATA1, OUTPUT_DATA2, OUTPUT_DATA3, OUTPUT_DATA4, OUTPUT_DATA5, OUTPUT_DATA6, OUTPUT_DATA7, OUTPUT_DATA8, OUTPUT_DATA9, OUTPUT_DATA10, OUTPUT_DATA11, OUTPUT_DATA12, OUTPUT_DATA13, OUTPUT_DATA[0..13], OUTPUT_DATA_ACK, OUTPUT_DATA_REQ, PULSE_GEN_RST, resetIFAT, ROW_SHIFT_REG_CLK, SHIFT_REG_D, SHIFT_REG_SET
mark named Analog_1.8v: AVDD, E_REV0, E_REV1, E_REV2, E_REV3, E_REV[0..3], ELEAK, GCOMP, GLEAK_DISTAL, GLEAK_PROXIMAL, GND, SYNAPSE_DRIVE_LOW, V_TAU0, V_TAU1, V_TAU2, V_TAU3, V_TAU[0..3], V_U_PROBE0, V_U_PROBE1, V_U_PROBE2, V_U_PROBE3, V_U_PROBE[0..3], VAMP_HIGH, VAMP_LOW, VBIAS, VBIAS_SF, VBIAS_UNITYBUFFER, VMEM_DISTAL_PROBE, VMEM_PROXIMAL_PROBE, VPDN, VREFR, VRESET, VSPIKE, VSS_SYNAPSE, VTHRESH
mark named Analog_1.2v: VBP, VINPUT_CURRENT_BIAS, Vpup_arb, VpupReq, WIDTH_BIAS, WIDTH_BIAS_HIGH, WIDTH_BIAS_LOW
mark named Power: AVDD, DVDD, DVDD_HIGH, EVDD, GND

### Library data of the parts
IFAT6 = SOCKET QFP_100: 100 pin QFP; Manufacturer_Name: Yamaichi Electronics; Datasheet Link: https://www.mouser.com/datasheet/2/448/Yamaichi_Electronics_08162018_IC149-100-x25-x5x_L-1391528.pdf; Mouser Price/Stock: https://www.mouser.com/ProductDetail/Yamaichi-Electronics/IC149-100-025-B5?qs=nO3wRANIIvnwx1%2FO7RgPQA%3D%3D&countrycode=US&currencycode=USD; Mouser Part Number: 945-IC149-100-025-B5

## Sheet Capx3_small_bypass.SchDoc
size A
Used 45 times, as channels IFAT6_Chip_QFP/C_EVDD, IFAT6_Chip_QFP/DVDD_HI, IFAT6_Chip_QFP/DVDD, IFAT6_Chip_QFP/VSS_SYN, IFAT6_Chip_QFP/VAMP_LOW, IFAT6_Chip_QFP/C_EVDD, IFAT6_Chip_QFP/GCOMP, IFAT6_Chip_QFP/ELEAK, IFAT6_Chip_QFP/C_AVDD, IFAT6_Chip_QFP/GL_DIS, IFAT6_Chip_QFP/GL_PROX, IFAT6_Chip_QFP/V_TAU3, IFAT6_Chip_QFP/V_TAU2, IFAT6_Chip_QFP/C_AVDD1, IFAT6_Chip_QFP/V_TAU0, IFAT6_Chip_QFP/VREFR, IFAT6_Chip_QFP/V_TAU1, IFAT6_Chip_QFP/VAMP_HIGH, IFAT6_Chip_QFP/VBIAS_BUFF, IFAT6_Chip_QFP/SYN_DR_LO, IFAT6_Chip_QFP/VBIAS_SF, IFAT6_Chip_QFP/E_REV0, IFAT6_Chip_QFP/E_REV1, IFAT6_Chip_QFP/E_REV2, IFAT6_Chip_QFP/E_REV3, IFAT6_Chip_QFP/VSPIKE, IFAT6_Chip_QFP/WBIAS, IFAT6_Chip_QFP/VPDN, IFAT6_Chip_QFP/VBIAS, IFAT6_Chip_QFP/VRESET, IFAT6_Chip_QFP/VTHRESH, IFAT6_Chip_QFP/VIN_IBIAS, IFAT6_Chip_QFP/WBIAS_HI, IFAT6_Chip_QFP/WBIAS_LO, IFAT6_Chip_QFP/VBP, IFAT6_Chip_QFP/VpupReq, IFAT6_Chip_QFP/VpupArb, U_Sig_Acq/C_+VDC3, U_Sig_Acq/C_+VDC2, U_Sig_Acq/C_+VDC1, BRK7010/C_VCCO2_FPGA, BRK7010/+VDC_FPGA5, BRK7010/+VDC_FPGA6, BRK7010/+VDC_FPGA7, BRK7010/C_VCCO1_FPGA. Parts and nets are listed once, with the designators drawn on the sheet.
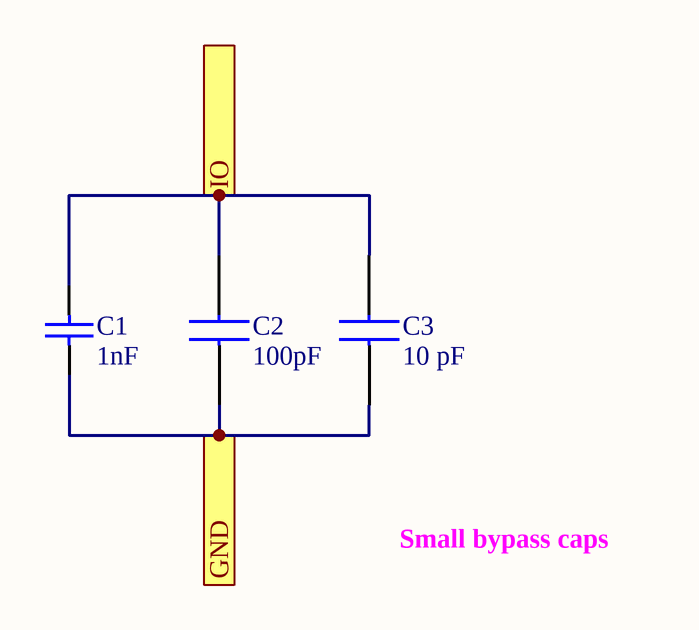
[diagram p3: Capx3_small_bypass.SchDoc]

### Parts
C1  value 1nF  [Samsung CL21B Series]  (hidden comment: Cap 1nF 0805)
C2  100pF  [CAPC1608X90N]
C3  10 pF  [CAPC2012X88N]

### Ports
GND, IO

### Nets
GND: C1.2 C2.1 C3.1 ; port GND
IO: C1.1 C2.2 C3.2 ; port IO

### Channels
IFAT6_Chip_QFP/C_EVDD: designators end in _IFAT6_Chip_QFP_C_EVDD#1; ports GND=DGND IO=EVDD
IFAT6_Chip_QFP/DVDD_HI: designators end in _DVDD_HI; ports GND=DGND IO=DVDD_HIGH
IFAT6_Chip_QFP/DVDD: designators end in _DVDD; ports GND=DGND IO=DVDD
IFAT6_Chip_QFP/VSS_SYN: designators end in _VSS_SYN; ports GND=DGND IO=VSS_SYNAPSE
IFAT6_Chip_QFP/VAMP_LOW: designators end in _VAMP_LOW; ports GND=DGND IO=VAMP_LOW
IFAT6_Chip_QFP/C_EVDD: designators end in _IFAT6_Chip_QFP_C_EVDD#2; ports GND=DGND IO=EVDD
IFAT6_Chip_QFP/GCOMP: designators end in _GCOMP; ports GND=DGND IO=GCOMP
IFAT6_Chip_QFP/ELEAK: designators end in _ELEAK; ports GND=DGND IO=ELEAK
IFAT6_Chip_QFP/C_AVDD: designators end in _C_AVDD; ports GND=DGND IO=AVDD
IFAT6_Chip_QFP/GL_DIS: designators end in _GL_DIS; ports GND=DGND IO=GLEAK_DISTAL
IFAT6_Chip_QFP/GL_PROX: designators end in _GL_PROX; ports GND=DGND IO=GLEAK_PROXIMAL
IFAT6_Chip_QFP/V_TAU3: designators end in _V_TAU3; ports GND=DGND IO=V_TAU3
IFAT6_Chip_QFP/V_TAU2: designators end in _V_TAU2; ports GND=DGND IO=V_TAU2
IFAT6_Chip_QFP/C_AVDD1: designators end in _C_AVDD1; ports GND=DGND IO=AVDD
IFAT6_Chip_QFP/V_TAU0: designators end in _V_TAU0; ports GND=DGND IO=V_TAU0
IFAT6_Chip_QFP/VREFR: designators end in _VREFR; ports GND=DGND IO=VREFR
IFAT6_Chip_QFP/V_TAU1: designators end in _V_TAU1; ports GND=DGND IO=V_TAU1
IFAT6_Chip_QFP/VAMP_HIGH: designators end in _VAMP_HIGH; ports GND=DGND IO=VAMP_HIGH
IFAT6_Chip_QFP/VBIAS_BUFF: designators end in _VBIAS_BUFF; ports GND=DGND IO=VBIAS_UNITYBUFFER
IFAT6_Chip_QFP/SYN_DR_LO: designators end in _SYN_DR_LO; ports GND=DGND IO=SYNAPSE_DRIVE_LOW
IFAT6_Chip_QFP/VBIAS_SF: designators end in _VBIAS_SF; ports GND=DGND IO=VBIAS_SF
IFAT6_Chip_QFP/E_REV0: designators end in _E_REV0; ports GND=DGND IO=E_REV0
IFAT6_Chip_QFP/E_REV1: designators end in _E_REV1; ports GND=DGND IO=E_REV1
IFAT6_Chip_QFP/E_REV2: designators end in _E_REV2; ports GND=DGND IO=E_REV2
IFAT6_Chip_QFP/E_REV3: designators end in _E_REV3; ports GND=DGND IO=E_REV3
IFAT6_Chip_QFP/VSPIKE: designators end in _VSPIKE; ports GND=DGND IO=VSPIKE
IFAT6_Chip_QFP/WBIAS: designators end in _WBIAS; ports GND=DGND IO=WIDTH_BIAS
IFAT6_Chip_QFP/VPDN: designators end in _VPDN; ports GND=DGND IO=VPDN
IFAT6_Chip_QFP/VBIAS: designators end in _VBIAS; ports GND=DGND IO=VBIAS
IFAT6_Chip_QFP/VRESET: designators end in _VRESET; ports GND=DGND IO=VRESET
IFAT6_Chip_QFP/VTHRESH: designators end in _VTHRESH; ports GND=DGND IO=VTHRESH
IFAT6_Chip_QFP/VIN_IBIAS: designators end in _VIN_IBIAS; ports GND=DGND IO=VINPUT_CURRENT_BIAS
IFAT6_Chip_QFP/WBIAS_HI: designators end in _WBIAS_HI; ports GND=DGND IO=WIDTH_BIAS_HIGH
IFAT6_Chip_QFP/WBIAS_LO: designators end in _WBIAS_LO; ports GND=DGND IO=WIDTH_BIAS_LOW
IFAT6_Chip_QFP/VBP: designators end in _VBP; ports GND=DGND IO=VBP
IFAT6_Chip_QFP/VpupReq: designators end in _VpupReq; ports GND=DGND IO=VpupReq
IFAT6_Chip_QFP/VpupArb: designators end in _VpupArb; ports GND=DGND IO=Vpup_arb
U_Sig_Acq/C_+VDC3: designators end in _C_+VDC3; ports GND=DGND IO=+VDC_BUFF
U_Sig_Acq/C_+VDC2: designators end in _C_+VDC2; ports GND=DGND IO=+VDC_BUFF
U_Sig_Acq/C_+VDC1: designators end in _C_+VDC1; ports GND=DGND IO=+VDC_BUFF
BRK7010/C_VCCO2_FPGA: designators end in _C_VCCO2_FPGA; ports GND=DGND IO=VCCO_MC1
BRK7010/+VDC_FPGA5: designators end in _+VDC_FPGA5; ports GND=DGND IO=+VDC
BRK7010/+VDC_FPGA6: designators end in _+VDC_FPGA6; ports GND=DGND IO=+VDC_3.3
BRK7010/+VDC_FPGA7: designators end in _+VDC_FPGA7; ports GND=DGND IO=+VDC_1.8
BRK7010/C_VCCO1_FPGA: designators end in _C_VCCO1_FPGA; ports GND=DGND IO=VCCO_MC1

### Notes on the sheet
- Small bypass caps

### Library data of the parts
C1 = Cap 1nF 0805: Ceramic Capacitor, Multilayer, Ceramic, 50V, 10% +Tol, 10% -Tol, X7R, 15% TC, 0.001uF, Surface Mount, 0805; Supplier 1: Digi-Key; Supplier Part Number 1: 1276-2424-1-ND
C2 = Cap 100pF 0603: Capacitor; Manufacturer_Name: AVX; Manufacturer_Part_Number: 06035A101FAT2A; Datasheet Link: https://componentsearchengine.com/Datasheets/1/06031A100FAT2A.pdf; Height: 0.9mm; Mouser Part Number: 581-06035A101F; Mouser Price/Stock: https://www.mouser.co.uk/ProductDetail/AVX/06035A101FAT2A?qs=AGOxcRBkg6ajfVvm2Jvp8A%3D%3D; Arrow Part Number: 06035A101FAT2A; Arrow Price/Stock: https://www.arrow.com/en/products/06035a101fat2a/avx?region=nac; Supplier 1: Digi-Key; Supplier Part Number 1: 478-6202-1-ND
C3 = Cap 10pF 0805: Capacitor; Manufacturer_Name: Kemet; Manufacturer_Part_Number: C0805C100J5GACTU; Datasheet Link: http://www.mouser.com/ds/2/212/KEM_C1003_C0G_SMD-356956.pdf; Height: 0.88mm; Mouser Part Number: 80-C0805C100J5G; Mouser Price/Stock: https://www.mouser.co.uk/ProductDetail/KEMET/C0805C100J5GACTU?qs=nxj9Bpd7lumc4YIny1qjLA%3D%3D; Arrow Part Number: C0805C100J5GACTU; Arrow Price/Stock: https://www.arrow.com/en/products/c0805c100j5gactu/kemet-corporation?region=nac; Supplier 1: Digi-Key; Supplier Part Number 1: 399-C0805C100J5GAC7800CT-ND